# EAGLE design untitled (EAGLE 9.6.2)
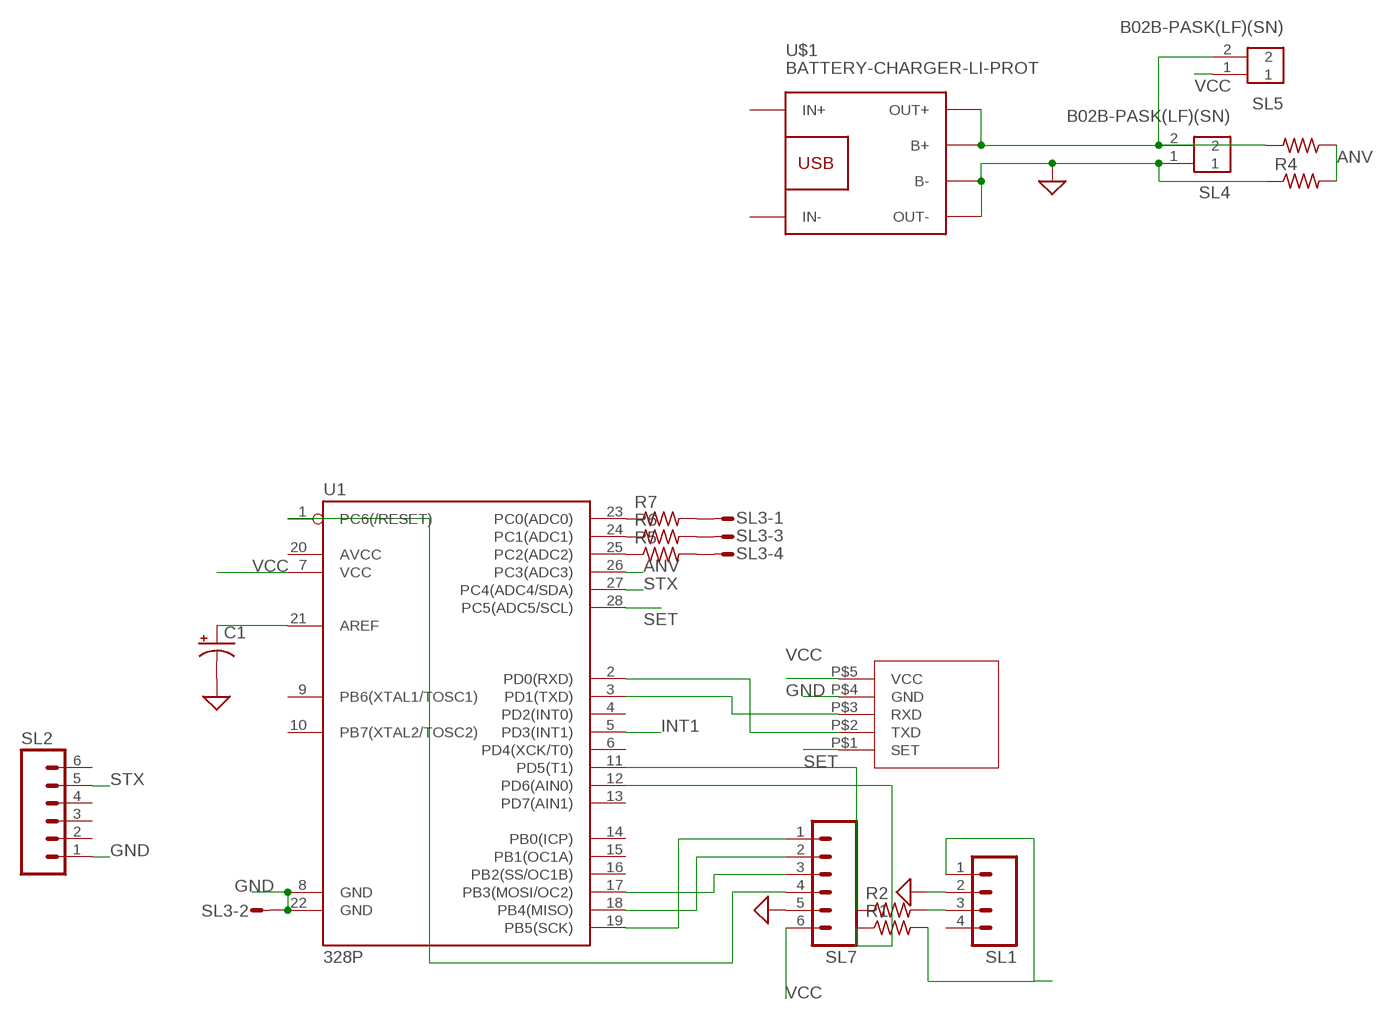
[diagram p0: schematic, sheet 1]

## Parts
C1  CAPACITOR-PE2.5-5  [E2,5-5]
R1  R-US_0309/10  [0309/10]
R2  R-US_0309/10  [0309/10]
R4  R-US_0207/7  [0207/7]
R5  R-US_0204/2V  [0204V]
R6  R-US_0204/2V  [0204V]
R7  R-US_0207/5V  [0207/5V]
R8  R-US_0207/7  [0207/7]
SL1  M04  [04P]
SL2  M06  [06P]
SL3  M04S  [04P]
SL4  B02B-PASK(LF)(SN)  [B02B-PASK(LF)(SN)]
SL5  B02B-PASK(LF)(SN)  [B02B-PASK(LF)(SN)]
SL7  M06  [06P]
U1  328P  ATMEGA328P_PDIP  [DIP28]
U$1  BATTERY-CHARGER-LI-PROT  [BATTERY-CHARGER-LI-PROT]
U$3  HC12  [HC12]

## Nets
ANV: R4.2 R8.1 U1.26(PC3(ADC3))
GND: C1.- R4.1 SL1.2 SL2.1 SL3.2 SL4.1 SL7.5 U1.8(GND) U1.22(GND) U$1.B- U$1.OUT- U$3.P$4(GND) ; supply symbol labelled SUP
INT1: U1.5(PD3(INT1))
N$1: C1.+ U1.21(AREF)
N$2: R1.2 SL1.1
N$3: SL7.1 U1.19(PB5(SCK))
N$4: SL7.2 U1.18(PB4(MISO))
N$5: SL7.3 U1.17(PB3(MOSI/OC2))
N$6: SL7.4 U1.1(PC6(/RESET))
N$7: R2.2 SL1.3
N$8: R2.1 U1.11(PD5(T1))
N$9: R1.1 U1.12(PD6(AIN0))
N$11: U1.2(PD0(RXD)) U$3.P$2(TXD)
N$12: U1.3(PD1(TXD)) U$3.P$3(RXD)
N$14: R5.1 U1.25(PC2(ADC2))
N$16: R5.2 SL3.4
N$17: R6.1 U1.24(PC1(ADC1))
N$18: R6.2 SL3.3
N$19: R7.1 U1.23(PC0(ADC0))
N$20: R7.2 SL3.1
N$24: R8.2 SL4.2 SL5.2 U$1.B+ U$1.OUT+
SET: U1.28(PC5(ADC5/SCL)) U$3.P$1(SET)
STX: SL2.5 U1.27(PC4(ADC4/SDA))
VCC: SL5.1 SL7.6 U1.7(VCC) U$3.P$5(VCC)
Unconnected: SL1.4 SL2.2 SL2.3 SL2.4 SL2.6 U1.4(PD2(INT0)) U1.6(PD4(XCK/T0)) U1.9(PB6(XTAL1/TOSC1)) U1.10(PB7(XTAL2/TOSC2)) U1.13(PD7(AIN1)) U1.14(PB0(ICP)) U1.15(PB1(OC1A)) U1.16(PB2(SS/OC1B)) U1.20(AVCC) U$1.IN+ U$1.IN-

## Library data of the parts
C1 = BeagleBone_Blue_R3:CAPACITOR-P: POLARIZED CAPACITOR, American symbol
R1 R2 R4-R8 = BeagleBone_Black_Wireless:R-US_: RESISTOR, American symbol
SL1 = con-amp-quick:M04: AMP QUICK CONNECTOR; OC_FARNELL: unknown; OC_NEWARK: unknown
SL2 SL7 = con-amp-quick:M06: AMP QUICK CONNECTOR; OC_FARNELL: unknown; OC_NEWARK: unknown
SL3 = con-amp-quick:M04S: AMP QUICK CONNECTOR; OC_FARNELL: unknown; OC_NEWARK: unknown
SL4 SL5 = Headers:B02B-PASK(LF)(SN): CONN HEADER VERT 2POS 2MM Manufacturer's datasheet <http://www.jst-mfg.com/product/pdf/eng/ePA-F.pdf>; CREATED_BY: PCBLayout.com; DIGIKEY_PARTNO: 455-1817-ND; MANUFACTURER: JST Sales America Inc.; MPN: B02B-PASK(LF)(SN)
U1 = SparkFun-IC-Microcontroller:ATMEGA328P_PDIP: Atmel 328P Through hole ATMEGA328P uC used in the Arduino 32kb flash, 1k EEPROM, 2k SRAM Datasheet <http://www.sparkfun.com/datasheets/Components/SMD/ATMega328.pdf> SparkFun Products Storefront component: AVR 28 Pin 20MHz 32K 6A/D - ATMega328P <https://www.sparkfun.com/products/9061> (COM-09061) SparkFun Simon Says - Through-Hole Soldering Kit <https://www.sparkfun.com/products/10547> (KIT-10547) SparkFun Learn to Solder - Simon Says <https://www.sparkfun.com/products/13708> (KIT-13708) SparkFun BigTime Watch Kit <https://www.sparkfun.com/products/11734> (KIT-11734) SparkFun ClockIt <https://www.sparkfun.com/products/10930> (KIT-10930) SparkFun Serial Enabled LCD Kit <https://www.sparkfun.com/products/10097> (LCD-10097) SparkFun Simon Tilts - Through Hole Soldering Kit <https://www.sparkfun.com/products/12634> (KIT-12634) SparkFun Frequency Counter Kit <https://www.sparkfun.com/products/10140> (KIT-10140) FabFM Radio Kit <https://www.sparkfun.com/products/11043> (KIT-11043) SparkFun Binary Blaster Kit <https://www.sparkfun.com/products/12037> (KIT-12037) SparkFun Metro-Gnome <https://www.sparkfun.com/products/9236> (KIT-09236) ATmega328 with Arduino Optiboot (Uno) <https://www.sparkfun.com/products/10524> (DEV-10524); PROD_ID: IC-09136
U$1 = diy-modules:BATTERY-CHARGER-LI-PROT: Lithium Battery 5V Charger with protection circuit More details available here: http://www.instructables.com/id/DIY-Lithium-ion-Battery-Charger/step4/TP4056-based-lithium-ion-battery-charger-module/ Click here to find device on ebay.com <http://www.ebay.com/sch/tp4056+charger+usb+protection>
U$3 = techart:HC12

## Board
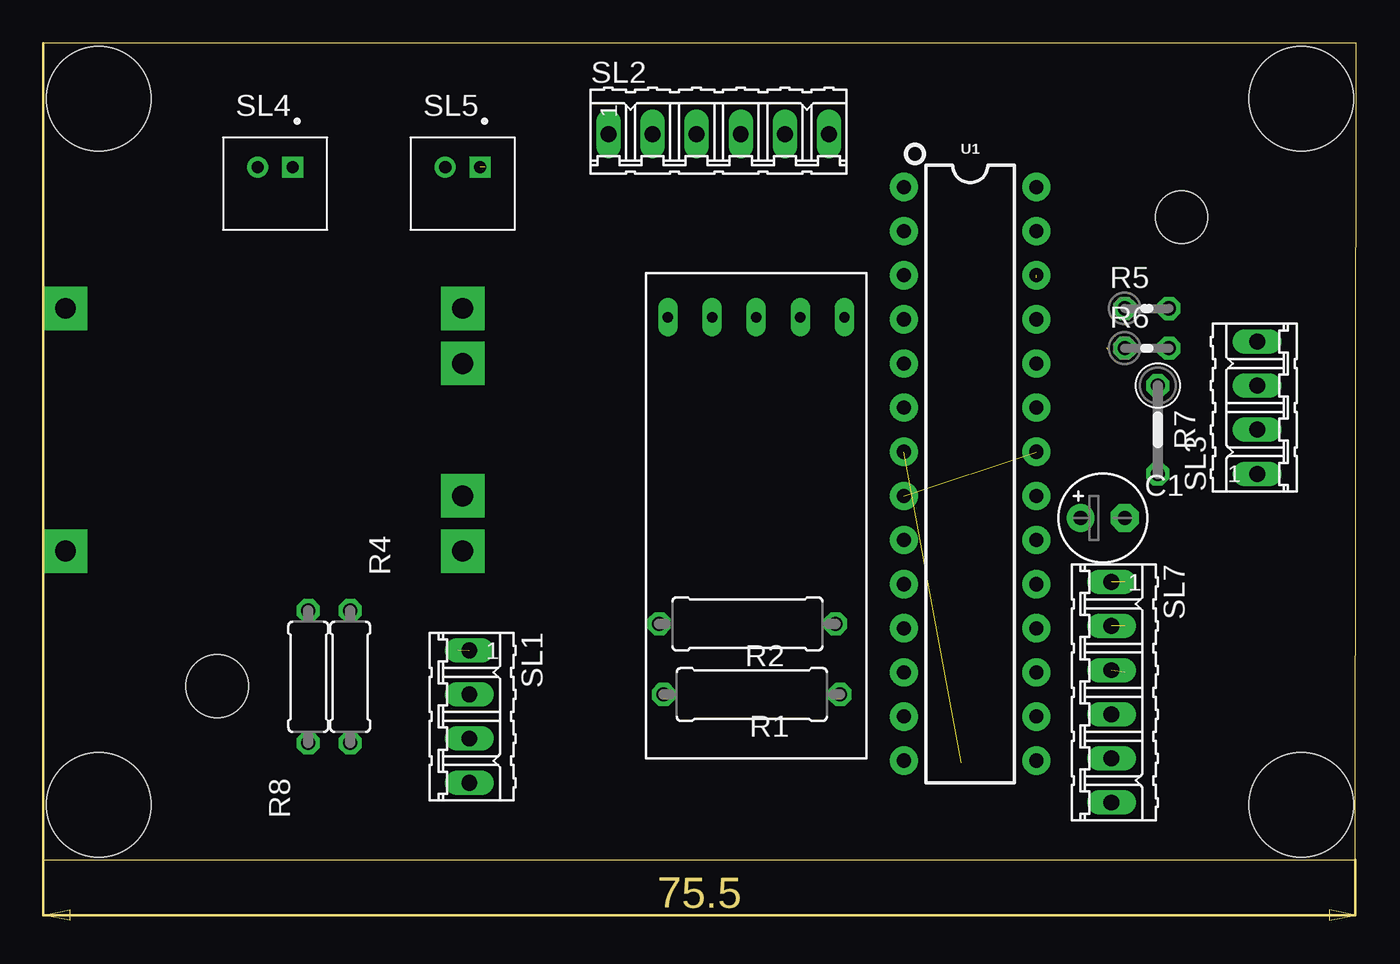
[diagram p1: board, top side]
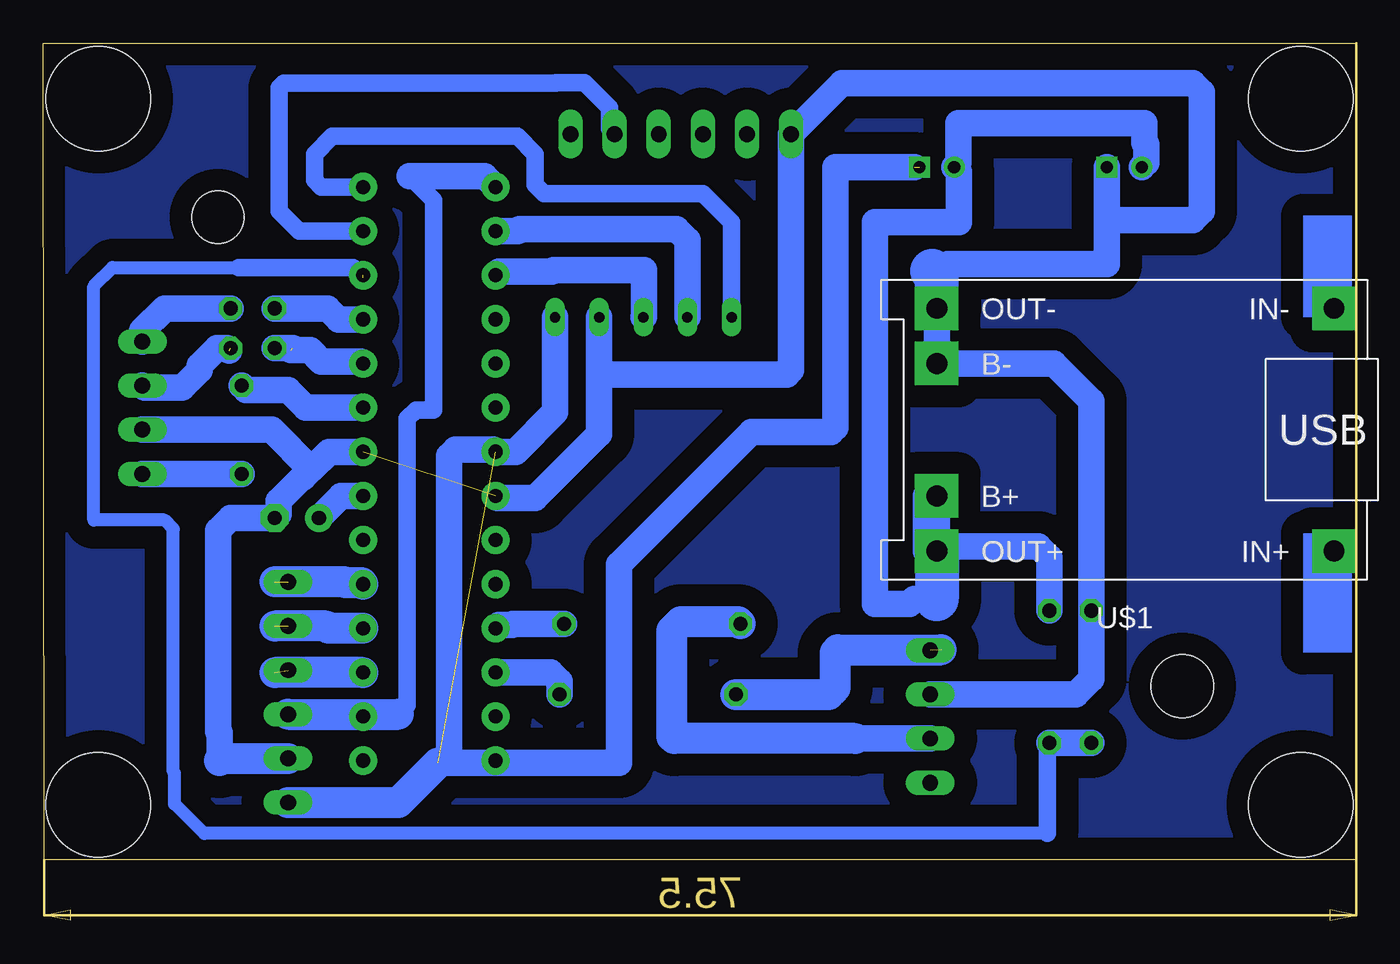
[diagram p2: board, bottom side, seen from below]

Size 75.55 x 47 mm. Coordinates in mm from the lower left corner, seen from the top.
Outline: 0,0 75.5,0 75.55,47 0,47 0,0
Copper layers (1*16): Top 0.035mm / dielectric 1.5mm / Bottom 0.035mm
Design rules "default *": minimum track width 6mil, minimum drill 0.35mm, track to track 30mil, track to pad 30mil, pad to pad 30mil, via to via 30mil, smd to smd 6mil, copper to edge 40mil, drill to drill 6mil, minimum pad ring 10mil, minimum via ring 8mil, stop-mask expansion 4mil, vias tented up to drill 0mil, thermal gap 10mil
Holes 6 mm at 3.17,43.81 3.17,3.17 72.39,3.17 72.39,43.81
Holes 3.6 mm at 10,10
Holes 3 mm at 65.5,37

### Footprints (pad centres in the part's own frame; a part is rotated, then mirrored left to right if it is on the bottom)
E2,5-5 = drill 0.813 pad 1.6: + -1.27,0 | drill 0.813 pad 1.6 octagon: - 1.27,0
0309/10 = drill 0.813 octagon: 1 -5.08,0; 2 5.08,0
0207/7 = drill 0.813 octagon: 1 -3.81,0; 2 3.81,0
0204V = drill 0.813 octagon: 1 -1.27,0; 2 1.27,0
0207/5V = drill 0.813 octagon: 1 -2.54,0; 2 2.54,0
04P = drill 0.914 long: 1 -3.81,0; 2 -1.27,0; 3 1.27,0; 4 3.81,0
06P = drill 0.914 long: 1 -6.35,0; 2 -3.81,0; 3 -1.27,0; 4 1.27,0; 5 3.81,0; 6 6.35,0
B02B-PASK(LF)(SN) = drill 0.7 square: 1 1,0 | drill 0.7: 2 -1,0
DIP28 = drill 0.813 pad 1.626: 1 -16.51,-3.81; 2 -13.97,-3.81; 3 -11.43,-3.81; 4 -8.89,-3.81; 5 -6.35,-3.81; 6 -3.81,-3.81; 7 -1.27,-3.81; 8 1.27,-3.81; 9 3.81,-3.81; 10 6.35,-3.81; 11 8.89,-3.81; 12 11.43,-3.81; 13 13.97,-3.81; 14 16.51,-3.81; 15 16.51,3.81; 16 13.97,3.81; 17 11.43,3.81; 18 8.89,3.81; 19 6.35,3.81; 20 3.81,3.81; 21 1.27,3.81; 22 -1.27,3.81; 23 -3.81,3.81; 24 -6.35,3.81; 25 -8.89,3.81; 26 -11.43,3.81; 27 -13.97,3.81; 28 -16.51,3.81
BATTERY-CHARGER-LI-PROT = drill 1.2 pad 2.5 square: B+ 10.795,3.81; B- 10.795,-3.81; IN+ -12.065,6.985; IN- -12.065,-6.985; OUT+ 10.795,6.985; OUT- 10.795,-6.985
HC12 = drill 0.6 long: P$1 5.08,5.08; P$2 5.08,2.54; P$3 5.08,0; P$4 5.08,-2.54; P$5 5.08,-5.08

### Placement (x,y rotation side)
C1  60.96,19.68 0 top
R1  40.77,9.53 180 top
R2  40.51,13.59 180 top
R4  15.24,10.54 270 top
R5  63.5,31.75 0 top
R6  63.5,29.46 0 top
R7  64.14,24.77 270 top
R8  17.65,10.54 90 top
SL1  24.51,8.26 270 top
SL2  38.86,41.78 0 top
SL3  69.85,26.04 90 top
SL4  13.34,39.88 0 top
SL5  24.13,39.88 0 top
SL7  61.47,9.65 270 top
U1  53.34,22.23 270 top
U$1  13.34,24.77 180 bottom
U$3  41.02,26.16 90 top

### Tracks (layer width: path | path; a pad name or v marks a point on that pad's centre or on a via)
ANV  (1 unrouted)
  Bottom 0.762: 64.3,34.1 71.56,34.1 72.64,33.02 72.64,19.56 68.58,19.56 68.07,19.05 68.07,5.08 67.99,5 67.99,3.22 66.29,1.52 17.78,1.52
  Bottom 1.016: 64.3,34.1 57.73,34.1 57.15,33.53 | R8.1 17.78,6.6 17.78,1.52
  Bottom 1.524: R4.2 R8.1
GND  (1 unrouted)
  Bottom 1.524: U$1.OUT- U$1.B- 17.4,28.57 15.24,26.42 R4.1 15.24,10.41 16.13,9.53 SL1.2 | 24.13,33.66 23.5,34.29 14.34,34.29 14.34,36.83 | SL4.1 14.34,36.83 | 65.41,5.71 65.41,7.3 65.5,7.39 65.5,18.96 64.77,19.68 C1.- 62.01,19.9 62.01,20.65 60.65,22.01 60.6,22.01 60.13,22.48 | U1.22 59.11,23.5 60.13,22.48 | 60.13,22.48 62.41,24.77 SL3.2 | U$3.P$4 43.56,27.94 | 43.56,27.94 43.56,24.51 47.24,20.83 49.4,20.83 U1.8 | 43.56,27.94 32.77,27.94 32.51,28.19 SL2.1 29.59,44.7 9.4,44.7 8.89,44.2 8.89,37.34 9.4,36.83 14.34,36.83
  Bottom 1.778: SL7.5 65.28,5.84 65.41,5.71
  Bottom 2.54: U$1.OUT- 24.13,33.66 24.38,33.91
N$1
  Bottom 1.524: U1.21 58.42,20.95 C1.+
N$2  (1 unrouted)
  Bottom 1.778: R1.2 30.35,9.53 29.97,9.91 29.97,11.94 29.82,12.09 23.88,12.09
N$3  (1 unrouted)
  Bottom 1.778: U1.19 57.23,15.95 58.17,15.95 58.22,16 62.23,16
N$4  (1 unrouted)
  Bottom 1.778: 62.23,13.46 59.27,13.46 59.15,13.34 U1.18
N$5  (1 unrouted)
  Bottom 1.778: U1.17 62.23,10.79
N$6
  Bottom 1.016: 55.12,8.38 54.61,8.89 54.61,25.4 54.1,25.91 53.09,25.91 53.09,37.97 54.48,39.37
  Bottom 1.524: 54.48,39.37 50.16,39.37 U1.1
  Bottom 1.778: SL7.4 55.12,8.38
N$7
  Bottom 1.524: SL1.3 28.83,6.99
  Bottom 1.778: 28.83,6.99 39.24,6.99 39.37,7.11 39.37,13.21 38.86,13.72 35.56,13.72 R2.2
N$8
  Bottom 1.524: R2.1 48.51,13.59 48.56,13.54 49.33,13.54 U1.11
N$9
  Bottom 1.524: R1.1 45.85,10.29 46.35,10.79 U1.12
N$10
  pour Bottom (isolate 1.27): 0,46.99 75.44,46.99 75.44,0 0,0
N$11
  Bottom 1.524: U$3.P$2 38.48,35.69 39.12,36.32 48.13,36.32 48.26,36.2 U1.2 49.46,36.2
N$12
  Bottom 1.524: U1.3 49.33,33.86 46.29,33.86 46.2,33.95 40.99,33.95 40.99,31.28 U$3.P$3
N$14
  Bottom 1.524: R5.1 59.18,31.75 58.55,31.11 U1.25
N$16
  Bottom 1.524: R5.2 68.58,31.75 69.85,30.48 SL3.4
N$17  (1 unrouted)
  Bottom 1.524: R6.1 61.21,29.46 | U1.24 57.28,28.7 59.56,28.7 60.2,29.34 61.3,29.34
N$18  (1 unrouted)
  Bottom 1.524: SL3.3 69.72,27.18 67.56,27.18 66.55,28.19 66.55,28.45 65.53,29.46 65.01,29.46 64.85,29.31
N$19
  Bottom 1.524: U1.23 60.45,26.04 61.47,27.05 63.88,27.05 R7.1
N$20
  Bottom 1.524: R7.2 SL3.1
N$24
  Bottom 1.524: SL4.2 12.08,40.13 12.08,41.16 12.19,41.27 12.19,42.42 22.86,42.42 22.88,42.4 22.88,40.13 SL5.2 22.86,39.61 22.86,36.7 27.69,36.7 27.69,14.73 25.7,14.73 25.42,15.01 24.13,15.01 24.13,17.14 | U$1.B+ U$1.OUT+ 24.13,17.14 | 24.13,17.14 24.77,17.78 24.77,20.95 | R8.2 17.65,17.4 18.29,18.03 23.24,18.03 24.13,17.14
  Bottom 2.54: U$1.OUT+ 24.13,15.01
SET
  Bottom 1.016: U$3.P$1 35.94,36.7 37.59,38.35 46.74,38.35 47.24,38.86 47.24,40.64 48.26,41.66 58.93,41.66 59.94,40.64 59.94,39.12 59.56,38.73 U1.28
STX
  Bottom 1.016: SL2.5 42.98,42.09 42.98,43.31 44.39,44.73 46.03,44.73 46.06,44.7 61.72,44.7 61.98,44.45 61.98,37.34 60.83,36.2 U1.27
VCC  (2 unrouted)
  Bottom 1.524: U$3.P$5 46.1,25.78 48.39,23.5 U1.7 49.66,23.62 51.82,23.62 52.2,23.24 52.2,5.59 42.42,5.59 42.42,17.02 34.8,24.64 32,24.64 30.23,24.64 29.97,24.89 29.97,39.88 25.42,39.88
  Bottom 1.778: SL7.6 55.12,3.3 52.83,5.59
(copper drawn outside any net)
  shapes: Bottom area x2